# Altium schematic sheet Sheet1.SchDoc
size A4; SheetNumber: 1; SheetTotal: 2
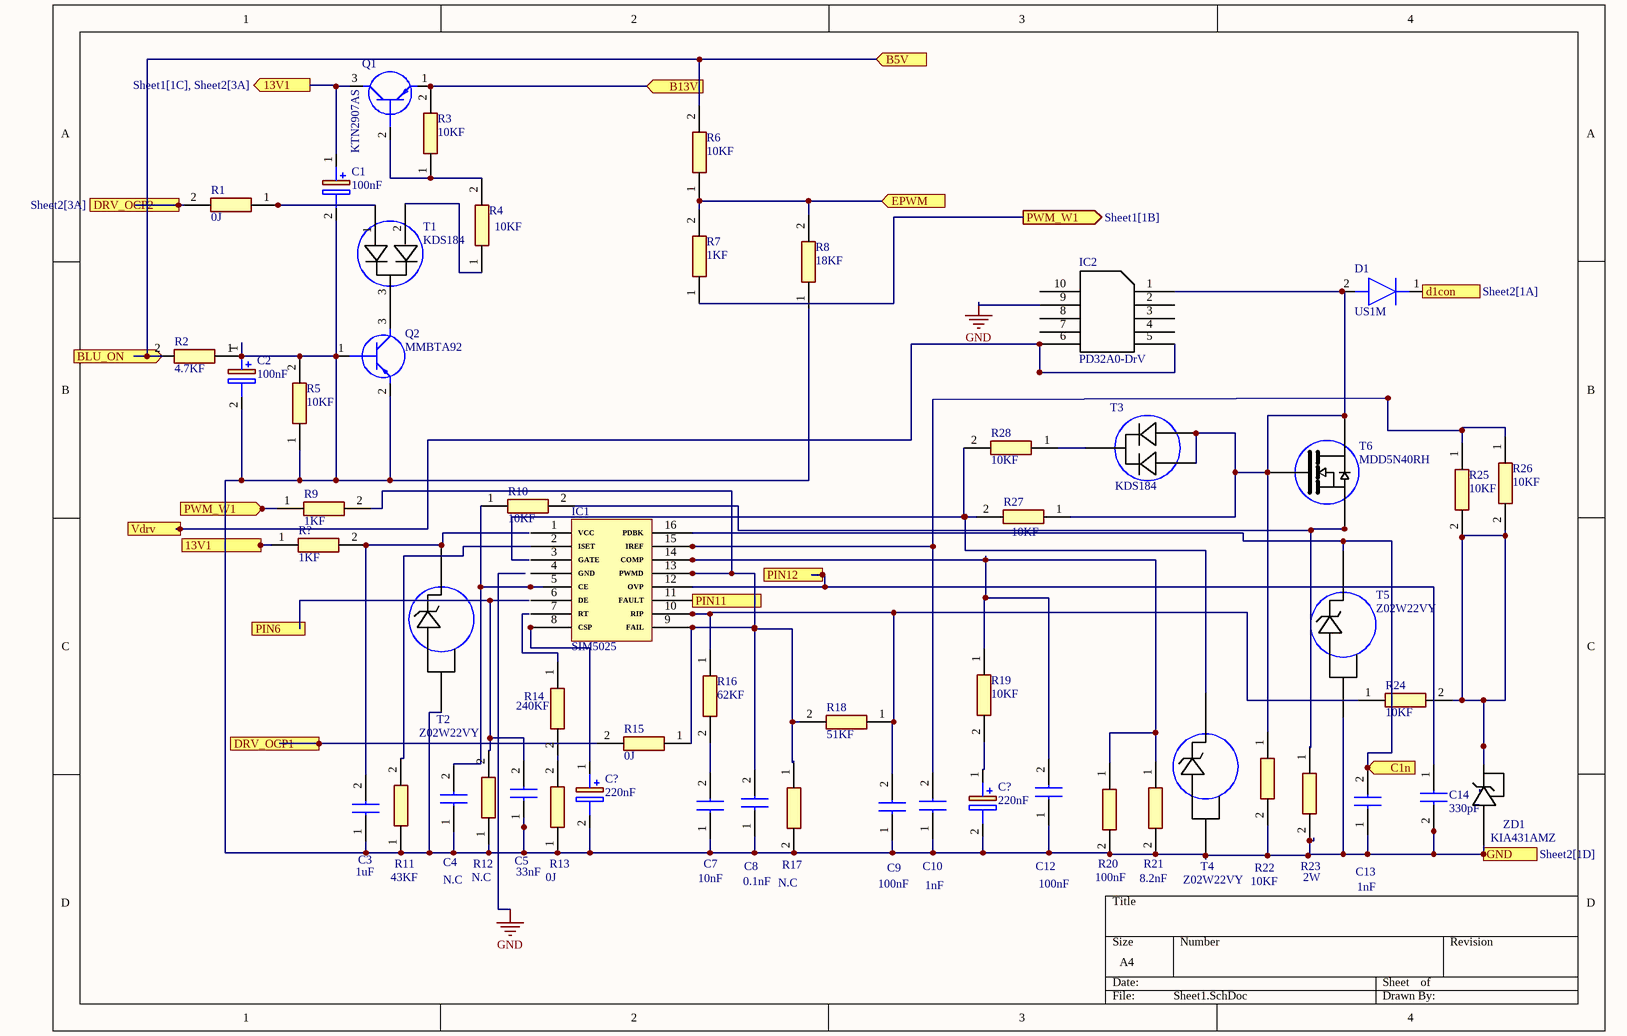
[diagram p0: Sheet1.SchDoc]

## Parts
(Parts that share a designator on the sheet are numbered #1, #2 ... from top to bottom, then left to right.)
C1  100nF  [CAPPRD150W50D400H600]
C2  100nF  [CAPPRD150W50D400H600]
C3  1uF  [CAPPRD200W55D525H1200]
C4  N.C  [CAPPRD200W55D525H1200]
C5  33nF  [CAPPRD200W55D525H1200]
C7  10nF  [CAPPRD200W55D525H1200]
C8  0.1nF  [CAPPRD200W55D525H1200]
C9  100nF  [CAPPRD200W55D525H1200]
C10  1nF  [CAPPRD200W55D525H1200]
C12  100nF  [CAPPRD200W55D525H1200]
C13  1nF  [CAPPRD200W55D525H1200]
C14  330pF  [FA18]
C?#1  220nF  [CAPPRD200W55D500H1250]
C?#2  220nF  [CAPPRD200W55D500H1250]
D1  US1M  [DIOM5127X229N]
IC1  SIM5025
IC2  PD32A0-DrV
Q1  KTN2907AS  [SOT95P245X130-3N]
Q2  MMBTA92  [SOT95P245X130-3N]
R1  0J  [RESAD1170W45L370D200]
R2  4.7KF  [RESAD1170W45L370D200]
R3  10KF  [RESAD1170W45L370D200]
R4  10KF  [RESAD1170W45L370D200]
R5  10KF  [RESAD1170W45L370D200]
R6  10KF  [RESAD1170W45L370D200]
R7  1KF  [RESAD1170W45L370D200]
R8  18KF  [RESAD1170W45L370D200]
R9  1KF  [RESAD1170W45L370D200]
R10  10KF  [RESAD1170W45L370D200]
R11  43KF  [RESAD1170W45L370D200]
R12  N.C  [RESAD1170W45L370D200]
R13  0J  [RESAD1170W45L370D200]
R14  240KF  [RESAD1170W45L370D200]
R15  0J  [RESAD1170W45L370D200]
R16  62KF  [RESAD1170W45L370D200]
R17  N.C  [RESAD1170W45L370D200]
R18  51KF  [RESAD1170W45L370D200]
R19  10KF  [RESAD1170W45L370D200]
R20  100nF  [RESAD1170W45L370D200]
R21  8.2nF  [RESAD1170W45L370D200]
R22  10KF  [RESAD1170W45L370D200]
R23  2W  [RESAD1170W45L370D200]
R24  10KF  [RESAD1170W45L370D200]
R25  10KF  [RESAD1170W45L370D200]
R26  10KF  [RESAD1170W45L370D200]
R27  10KF  [RESAD1170W45L370D200]
R28  10KF  [RESAD1170W45L370D200]
R?  1KF  [RESAD1170W45L370D200]
T1  KDS184
T2  Z02W22VY
T3  KDS184
T4  Z02W22VY
T5  Z02W22VY
T6  MDD5N40RH
ZD1  KIA431AMZ

## Ports
13V1 (in, see Sheet1[1A], Sheet2[3A]), 13V1 (out, see Sheet1[1C], Sheet2[3A]), B5V (in), B13V (in), BLU_ON (in), C1n (in, see Sheet2[2C]), d1con (in, see Sheet2[1A]), DRV_OCP1 (out), DRV_OCP2 (in, see Sheet2[3A]), EPWM (in), GND (in, see Sheet2[1D]), PIN6 (in, see Sheet2[3D]), PIN11 (in, see Sheet2[2C]), PIN12 (in, see Sheet2[1C]), PWM_W1 (in, see Sheet1[3A]), PWM_W1 (out, see Sheet1[1B]), Vdrv (in)

## Nets
GND: IC2.9
13V1: C1.1(+) Q1.3(C) R?.1 ; port 13V1
B5V: R2.2 R6.2 ; port BLU_ON, port B5V
B13V: Q1.1(E) R3.2 ; port B13V
C1n: C13.2(-) IC1.16(PDBK) T5.1 ; port C1n
d1con: D1.1(K) ; port d1con
DRV_OCP1: R15.2 ; port DRV_OCP1
DRV_OCP2: R1.2 ; port DRV_OCP2
EPWM: R6.1 R7.2 R8.2 ; port EPWM
GND: C1.2(-) C2.1(+) C2.2(-) C3.1(+) C4.1(+) C5.1(+) C7.1(+) C8.1(+) C9.1(+) C10.1(+) C12.1(+) C13.1(+) C14.2 C?#1.2(-) C?#2.2(-) Q2.1(B) Q2.2(E) R2.1 R5.1 R5.2 R8.1 R11.1 R12.1 R13.1 R17.2 R20.2 R21.2 R22.2 R23.2 T2.2 T4.2 T5.2 ZD1.66 ; port GND  [a separate net that carries the same name]
PIN11: IC1.11(FAULT) ; port PIN11
PIN12: C14.1 IC1.12(OVP) ; port PIN12
PWM_W1: R7.1 R9.1 ; port PWM_W1
Vdrv: IC2.5 IC2.6 ; port Vdrv
NetC3_2: C3.2(-) R?.2 T2.1
NetC4_2: C4.2(-) IC1.5(CE) R10.1
NetC5_2: C5.2(-) R12.2
NetC7_2: C7.2(-) R16.2
NetC8_2: C8.2(-) IC1.9(FAIL) IC1.13(PWMD) R9.2 R15.1 R17.1 R18.2
NetC9_2: C9.2(-) IC1.10(RIP) R16.1 R18.1 R24.1
NetC10_2: C10.2(-) IC1.15(IREF) R25.1 R26.1
NetC12_2: C12.2(-) IC1.14(COMP) R19.1 R20.1 R21.1
NetC?#1_1: C?#1.1(+) IC1.8(CSP)
NetC?#2_1: C?#2.1(+) R19.2
NetD1_2: D1.2(A) IC2.1 R22.1 R27.1 T3.1 T3.2 T6.70 T6.72
NetIC1_2: IC1.2(ISET) R11.2
NetQ1_2: Q1.2(B) R3.1 R4.2
NetQ2_3: Q2.3(C) T1.3
NetR1_1: R1.1 T1.1
NetR4_1: R4.1 T1.2
NetR10_2: R10.2 R23.1 T6.71
NetR13_2: R13.2 R14.2
NetR24_2: R24.2 R25.2 R26.2 ZD1.67
NetR27_2: R27.2 R28.2 T4.1
NetR28_1: R28.1 T3.3

Not connected (* = marked no-connect by the designer): IC1 1(VCC) 3(GATE) 4(GND) 6(DE) 7(RT); IC2 2(55) 3(56) 4(57) 7(62) 8(61) 10(59); R14 1

## Library data of the parts
C1 C2 = ECEA1HKS0R1: Capacitor Polarised; Manufacturer_Name: Panasonic; Datasheet Link: https://componentsearchengine.com/Datasheets/2/ECEA1HKS0R1.pdf; Height: 6mm; Manufacturer_Part_Number: ECEA1HKS0R1
C3-C5 C7-C10 C12 C13 = ECA-1HM0R1: Capacitor; Manufacturer_Name: Panasonic; Height: 12mm; Manufacturer_Part_Number: ECA-1HM0R1; Mouser Part Number: 667-ECA-1HM0R1; Mouser Price/Stock: https://www.mouser.com/Search/Refine.aspx?Keyword=667-ECA-1HM0R1
C14 = FA18C0G1H331JNU06: Capacitor; Manufacturer_Name: TDK; Datasheet Link: https://product.tdk.com/system/files/dam/doc/product/capacitor/ceramic/lead-mlcc/catalog/leadmlcc_halogenfree_fa_en.pdf; Height: 5.5mm; Manufacturer_Part_Number: FA18C0G1H331JNU06; Mouser Part Number: 810-FA18C0G1H331JNU6; Mouser Price/Stock: https://www.mouser.com/Search/Refine.aspx?Keyword=810-FA18C0G1H331JNU6
C?#1 C?#2 = EEUHD1HR22: Capacitor Polarised; Manufacturer_Name: Panasonic; Datasheet Link: http://industrial.panasonic.com/cdbs/www-data/pdf/RDF0000/ABA0000C1035.pdf; Height: 12.5mm; Manufacturer_Part_Number: EEUHD1HR22
D1 = US1M-E3_61T: Diode; Manufacturer_Name: Vishay; Manufacturer_Part_Number: US1M-E3/61T; Datasheet Link: https://componentsearchengine.com/Datasheets/2/US1M-E3_61T.pdf; Height: 2.29mm; Mouser Part Number: 625-US1M-E3; Mouser Price/Stock: https://www.mouser.co.uk/ProductDetail/Vishay-General-Semiconductor/US1M-E3-61T?qs=D6r9GjgEnNOosWuyVR8q1A%3D%3D; Arrow Part Number: US1M-E3/61T; Arrow Price/Stock: https://www.arrow.com/en/products/us1m-e361t/vishay?region=europe
Q1 = KTN2907AS: Transistor BJT PNP; Manufacturer_Name: KEC; Datasheet Link: https://4donline.ihs.com/images/VipMasterIC/IC/KECC/KECC-S-A0011628695/KECC-S-A0011628695-1.pdf?hkey=EF798316E3902B6ED9A73243A3159BB0; Height: 1.3mm; Manufacturer_Part_Number: KTN2907AS
Q2 = MMBTA92: Transistor BJT PNP; Manufacturer_Name: KEC; Datasheet Link: https://www.alldatasheet.com/datasheet-pdf/pdf/69996/KEC/MMBTA92.html; Height: 1.3mm; Manufacturer_Part_Number: MMBTA92
R1-R28 R? = MFR3-10KFC: Resistor; Manufacturer_Name: TT Electronics; Datasheet Link: https://componentsearchengine.com/Datasheets/2/MFR3-10KFC.pdf; Manufacturer_Part_Number: MFR3-10KFC; Mouser Part Number: 756-MFR3-10KFC; Mouser Price/Stock: https://www.mouser.co.uk/ProductDetail/Welwyn-Components-TT-Electronics/MFR3-10KFC?qs=i9QNUsDsAPN%252BMi4lKUEV5Q%3D%3D; Arrow Part Number: MFR3-10KFC; Arrow Price/Stock: https://www.arrow.com/en/products/mfr3-10kfc/welwyn-components?region=europe